# Altium schematic sheet cpuPower.SchDoc
size 420 x 297 mm; Scale: 1:1; DocumentType: Схема электрическая принципиальная; FirstReferrence: АБВГ.123456.001
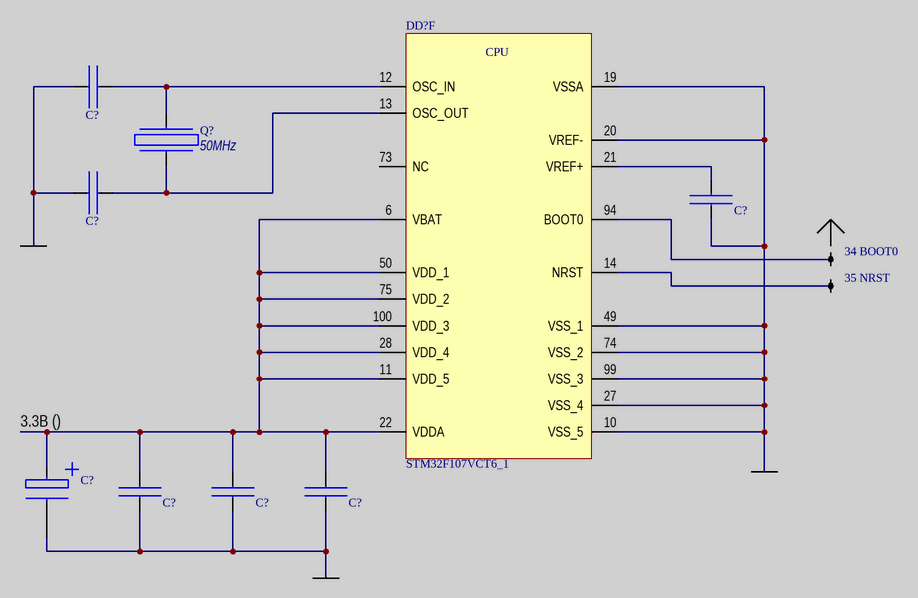
[diagram p0: cpuPower.SchDoc]

## Parts
(Parts that share a designator on the sheet are numbered #1, #2 ... from top to bottom, then left to right.)
C?#1  ?  [CAP0805]  (value not drawn)
C?#2  ?  [CAP0805]  (value not drawn)
C?#3  ?  [CAP0805]  (value not drawn)
C?#4  C_3  (value not drawn)
C?#5  ?  [CAP0805]  (value not drawn)
C?#6  ?  [CAP0805]  (value not drawn)
C?#7  ?  [CAP0805]  (value not drawn)
DD?  STM32F107VCT6_1  [LQFP100_N]  (part F of 6)
Q?  50MHz  [РК386]
X?#1  34 BOOT0  [PLD40]  (part 34 of 40)
X?#2  35 NRST  [PLD40]  (part 35 of 40)

## Nets
NetC?#1_1: C?#1.1 DD?.12(OSC_IN) Q?.2
NetC?#1_2: C?#1.2 C?#2.1
NetC?#2_2: C?#2.2 DD?.13(OSC_OUT) Q?.1
NetC?#3_1: C?#3.1 DD?.10(VSS_5) DD?.19(VSSA) DD?.20(VREF-) DD?.27(VSS_4) DD?.49(VSS_1) DD?.74(VSS_2) DD?.99(VSS_3)
NetC?#3_2: C?#3.2 DD?.21(VREF+)
NetC?#4_1: C?#4.1 C?#5.2 C?#6.2 C?#7.2 DD?.6(VBAT) DD?.11(VDD_5) DD?.22(VDDA) DD?.28(VDD_4) DD?.50(VDD_1) DD?.75(VDD_2) DD?.100(VDD_3)
NetC?#5_1: C?#5.1 C?#6.1 C?#7.1
NetDD?_14: DD?.14(NRST) X?#2.35
NetDD?_94: DD?.94(BOOT0) X?#1.34

Not connected (* = marked no-connect by the designer): C?#4 2; DD? 73(NC)

## Notes on the sheet
- (near C?#4) 3.3В ()
- Подп. и дата
- Инв. № дубл.
- Взам. инв. №
- Инв. № подл.
- Изм.
- Лист
- № докум.
- Подп.
- Дата
- 2.106-A3
- Копировал
- Формат А3
- (in symbol STM32F107VCT6_1, part F) CPU

## Library data of the parts
C?#1-C?#3 C?#5-C?#7 = C_2
Q? = 9B50.000MEEJ-B
X?#1 X?#2 = PLD40